# Altium schematic sheet Contactos.SchDoc
size A4; SheetNumber: 3; SheetTotal: 4
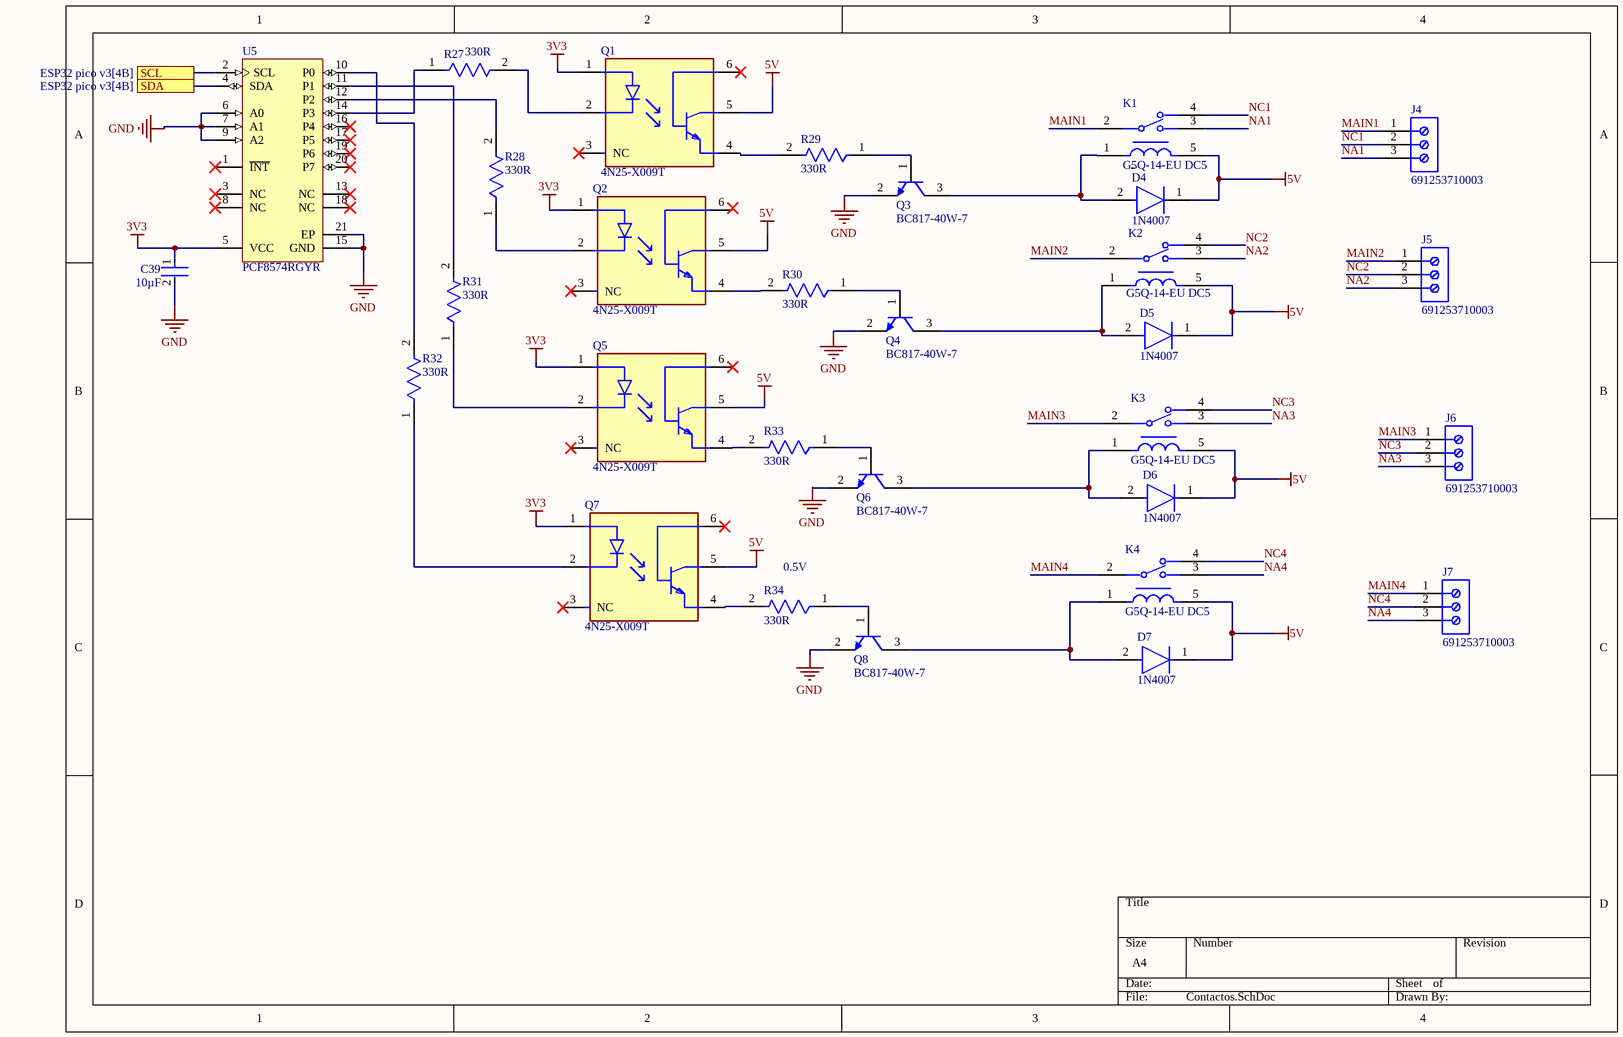
[diagram p0: Contactos.SchDoc]

## Parts
C39  Capacitance: 10µF  [FP-CC0603-DC-MFG]  (hidden comment: CC0603KRX5R7BB106)
D4  1N4007  [FP-1N4007-MFG]
D5  1N4007  [FP-1N4007-MFG]
D6  1N4007  [FP-1N4007-MFG]
D7  1N4007  [FP-1N4007-MFG]
J4  691253710003  [691253710003]
J5  691253710003  [691253710003]
J6  691253710003  [691253710003]
J7  691253710003  [691253710003]
K1  G5Q-14-EU DC5  [FP-G5Q-14-EU_DC5-MFG]
K2  G5Q-14-EU DC5  [FP-G5Q-14-EU_DC5-MFG]
K3  G5Q-14-EU DC5  [FP-G5Q-14-EU_DC5-MFG]
K4  G5Q-14-EU DC5  [FP-G5Q-14-EU_DC5-MFG]
Q1  4N25-X009T  [FP-4N25-X009T-MFG]
Q2  4N25-X009T  [FP-4N25-X009T-MFG]
Q3  BC817-40W-7  [DIOD-SOT323-3_V]
Q4  BC817-40W-7  [DIOD-SOT323-3_V]
Q5  4N25-X009T  [FP-4N25-X009T-MFG]
Q6  BC817-40W-7  [DIOD-SOT323-3_V]
Q7  4N25-X009T  [FP-4N25-X009T-MFG]
Q8  BC817-40W-7  [DIOD-SOT323-3_V]
R27  Resistance: 330R  [FP-CRCW0603-e3-MFG]  (hidden comment: CRCW0603330RFKEA)
R28  Resistance: 330R  [FP-CRCW0603-e3-MFG]  (hidden comment: CRCW0603330RFKEA)
R29  Resistance: 330R  [FP-CRCW0603-e3-MFG]  (hidden comment: CRCW0603330RFKEA)
R30  Resistance: 330R  [FP-CRCW0603-e3-MFG]  (hidden comment: CRCW0603330RFKEA)
R31  Resistance: 330R  [FP-CRCW0603-e3-MFG]  (hidden comment: CRCW0603330RFKEA)
R32  Resistance: 330R  [FP-CRCW0603-e3-MFG]  (hidden comment: CRCW0603330RFKEA)
R33  Resistance: 330R  [FP-CRCW0603-e3-MFG]  (hidden comment: CRCW0603330RFKEA)
R34  Resistance: 330R  [FP-CRCW0603-e3-MFG]  (hidden comment: CRCW0603330RFKEA)
U5  PCF8574RGYR  [RGY0020A_V]

## Ports
SCL (see ESP32 pico v3[4B]), SDA (see ESP32 pico v3[4B])

## Nets
3V3: C39.1 Q1.1(A) Q2.1(A) Q5.1(A) Q7.1(A) U5.5(VCC)
5V: D4.1(C) D5.1(C) D6.1(C) D7.1(C) K1.5 K2.5 K3.5 K4.5 Q1.5(C) Q2.5(C) Q5.5(C) Q7.5(C)
GND: C39.2 Q3.2(E) Q4.2(E) Q6.2(E) Q8.2(E) U5.6(A0) U5.7(A1) U5.9(A2) U5.15(GND) U5.21(EP)
MAIN1: J4.1 K1.2
MAIN2: J5.1 K2.2
MAIN3: J6.1 K3.2
MAIN4: J7.1 K4.2
NA1: J4.3 K1.3
NA2: J5.3 K2.3
NA3: J6.3 K3.3
NA4: J7.3 K4.3
NC1: J4.2 K1.4
NC2: J5.2 K2.4
NC3: J6.2 K3.4
NC4: J7.2 K4.4
SCL: U5.2(SCL) ; port SCL
SDA: U5.4(SDA) ; port SDA
NetD4_2: D4.2(A) K1.1 Q3.3(C)
NetD5_2: D5.2(A) K2.1 Q4.3(C)
NetD6_2: D6.2(A) K3.1 Q6.3(C)
NetD7_2: D7.2(A) K4.1 Q8.3(C)
NetQ1_2: Q1.2(C) R27.2
NetQ1_4: Q1.4(E) R29.2
NetQ2_2: Q2.2(C) R28.1
NetQ2_4: Q2.4(E) R30.2
NetQ3_1: Q3.1(B) R29.1
NetQ4_1: Q4.1(B) R30.1
NetQ5_2: Q5.2(C) R31.1
NetQ5_4: Q5.4(E) R33.2
NetQ6_1: Q6.1(B) R33.1
NetQ7_2: Q7.2(C) R32.1
NetQ7_4: Q7.4(E) R34.2
NetQ8_1: Q8.1(B) R34.1
NetR27_1: R27.1 U5.14(P3)
NetR28_2: R28.2 U5.12(P2)
NetR31_2: R31.2 U5.11(P1)
NetR32_2: R32.2 U5.10(P0)

Not connected (* = marked no-connect by the designer): Q1 3(NC)* 6(B)*; Q2 3(NC)* 6(B); Q5 3(NC)* 6(B)*; Q7 3(NC)* 6(B)*; U5 1(~{INT})* 3(NC)* 8(NC)* 13(NC)* 16(P4)* 17(P5)* 18(NC)* 19(P6)* 20(P7)*

## Notes on the sheet
- (near R34) 0.5V

## Library data of the parts
C39 = CMP-00621-81932632-1: CC0603KRX5R7BB106 Multilayer Ceramic Capacitor, 10 uF, 16 V, ± 10%, X5R, 0603 [1608 Metric]; Voltage Rating: 16V; NexarPartId: 81932632; Height: 1mm; Halogen Free: Halogen Free; Dielectric: X5R; Max Operating Temperature: 85°C; Voltage Rating (DC): 16V; Material: Ceramic; Lead Free: Lead Free; Tolerance: 10%; RoHS: Non-Compliant; Min Operating Temperature: -55°C; Case/Package: 0603
D4-D7 = CMP-123542-000001-1: Rectifier diode 1000 V 1 A DO-41, ,; Manufacturer: Diotec; Max Surge Forward Current: 27A; Forward Current: 1A; Max Junction Temp: +175°C; Reverse Voltage: 1000V; Value: 15pF; Peak Reverse Current: 5uA; Category: Diode; Temperature Range Low: -50°C; Automotive: No; Temperature: -50°C to +175°C; Lead Free: Yes; ComponentLink2Description: Datasheet; Max Repetitive Reverse Voltage: 1000V; ComponentLink2URL: https://datasheet.octopart.com/1N4007-Diotec-datasheet-62346875.pdf; Manufacturer Part Number: 1N4007; Device Class L3: Rectifier Diodes; Height: 2.8mm; Octopart: https://octopart.com/1n4007-diotec-4040411; Package: 1N4007; Temperature Range High: +175°C; Device Class L1: Discrete Semiconductors; Device Class L2: Diodes; RoHS: TRUE; Capacitance: 15pF; Ipc Land Pattern Name: DIOAD888W100L520D280
J4-J7 = CMP-1502-02590-3: Terminal Block, 5.08MM Pitch, Horizontal, Modular, Rising Cage Clamp, 3PINS
K1-K4 = CMP-08822-000046-1: RELAY GEN PURPOSE SPDT 10A 5V; Coil Resistance: 63R; Coil Type: Non-Latching; Coil Power: 400mW; Release Time: 5ms; Max Voltage Rating (AC): 277V; Operate Time: 10ms; Coil Current: 80mA; Max Voltage Rating (DC): 30V; Relay Type: General Purpose; Number of Pins: 5; Throw Configuration: SPDT; Contact Material: Silver; Coil Voltage (DC): 5V; Packaging: Bulk; Min Operating Temperature: -40°C; RoHS Compliant: Yes; Max Operating Temperature: 85°C; Contact Current Rating: 10A; Package Quantity: 400; Voltage Rating (AC): 277V; Mount: Through Hole; Series: G5Q-EU; Depth: 10.3mm; Length: 20.3mm; Termination: PC Pin
Q1 Q2 Q5 Q7 = CMP-00030-12292229-1: 4N25-X009T Optocoupler DC-IN 1-CH Transistor With Base DC-OUT 6-Pin PDIP SMD T/R; Max Collector Current: 100mA; Number of Channels: 1; Forward Current: 60mA; Collector Emitter Saturation Voltage: 500mV; Collector Emitter Voltage (VCEO): 70V; Output Current per Channel: 50mA; Current Transfer Ratio: 50%; Max Power Dissipation: 150mW; Forward Voltage: 1.36V; Reverse Breakdown Voltage: 6V; NexarPartId: 12292229; Radiation Hardening: No; Min Operating Temperature: -55°C; Packaging: Tape & Reel (TR); Lead Free: Lead Free; Number of Pins: 6; Max Output Voltage: 70V; RoHS: Compliant; Contact Plating: Tin; Case/Package: SMD/SMT; Number of Elements: 1; Max Operating Temperature: 100°C; Mount: Surface Mount; Power Dissipation: 150mW; Max Input Current: 60mA
Q3 Q4 Q6 Q8 = CMP-2000-05934-1: NPN Small Signal Transistor, 45 V, 500 mA, -65 to 150 degC, 3-Pin SOT323, RoHS, Tape and Reel; Manufacturer: DiodesIncorporated; Configuration: Single; Collector- Emitter Voltage VCEO Max: 45V; Emitter- Base Voltage VEBO: 5V; DC Collector/Base Gain hfe Min: 250; Collector-Emitter Saturation Voltage: 0.7V; Collector- Base Voltage VCBO: 50V; Maximum DC Collector Current: 1A; Pd - Power Dissipation: 200mW; Gain Bandwidth Product fT: 100MHz; Unit Weight: 0.000282oz; Series: BC817; Datasheet Version: Rev. 5-2, 01/2014; Datasheet URL: http://www.diodes.com/_files/datasheets/ds30575.pdf; Manufacturer URL: http://www.diodes.com/; Length: 2.2mm; Mounting Style: SMD/SMT; Maximum Operating Temperature: +150C; Package Description: 3-Pin Small Outline Transistor, Body 2 x 1.25 mm, Pitch 0.65 mm; Width: 1.35mm; RoHS: True; Minimum Operating Temperature: -65C; Brand: DiodesIncorporated; Product Category: BipolarTransistors-BJT; Height: 1mm; Factory Pack Quantity: 3000; Package / Case: SOT-23; Packaging: Reel; Transistor Polarity: NPN; Mounting Technology: SurfaceMount; Package Reference: SOT323
R27-R34 = CMP-1012-00454-3: RES Thick Film, 330Ω, 1%, 0.1W, 100ppm/°C, 0603; Voltage Rating: 75V; Max Power Dissipation: 100mW; Depth: 0.85mm; Contact Plating: Tin; Package Quantity: 10; Termination: SMD/SMT; Tolerance: 1%; Height: 0.45mm; Number of Terminations: 2; Radiation Hardening: No; Features: Automotive AEC-Q200; Case/Package: 0603; Mount: Surface Mount; Case Code (Metric): 1608; Lead Free: Lead Free; Temperature Coefficient: 100ppm/°C; Weight: 7.1E-05oz; Military Standard: Not; Packaging: Tape and Reel; Max Operating Temperature: 155°C; Voltage Rating (DC): 75V; Length: 1.55mm; Min Operating Temperature: -55°C; Composition: Thick Film; Case Code (Imperial): 0603; Width: 0.033inch; Power Rating: 100mW
U5 = CMP-0314-00026-2: Remote 8-Bit I/O Expander for I2C-Bus, 2.5 to 6 V, -40 to 85 degC, 20-pin VQFN (RGY), Green (RoHS & no Sb/Br); Manufacturer: Texas Instruments; Push-Pull I/O Type: Yes; SubFamily: I2C IO Expander; I2C Address: 0100 xxx; Voltage Nodes(V): 5, 3.3; fSCLK(Max)(MHz): 0.1; VCC(Min)(V): 2.5; # of I/Os: 8; Max Frequency(kHz): 100; VCC(Max)(V): 6; Vcc range(V): 2.5 to 6.0; PackageReference: RGY0020A; ComponentLink1URL: http://www.ti.com/general/docs/lit/getliterature.tsp?genericPartNumber=PCF8574&fileType=pdf; ComponentLink1Description: Datasheet; Mounting Technology: Surface Mount; PackageDescription: 20-Leads Plastic Quad Flatpack No-Lead, 3.5 x 4.5 x 0.9 mm Body, 0.5 mm Pitch; PackageVersion: revI, Jun-2011; ComponentLink2Description: Package Specification; ComponentLink2URL: http://www.ti.com/litv/pdf/mpss024a; Code_JEDEC: MO-241-BA; Interrupt Output: Yes; PartNumber: PCF8574RGYR; DatasheetVersion: SCPS068G; Reset Input: No; Eco-Plan: Green (RoHS & no Sb/Br)